# Altium schematic sheet Pont en H.SchDoc
size A4; SheetNumber: 1; SheetTotal: 1
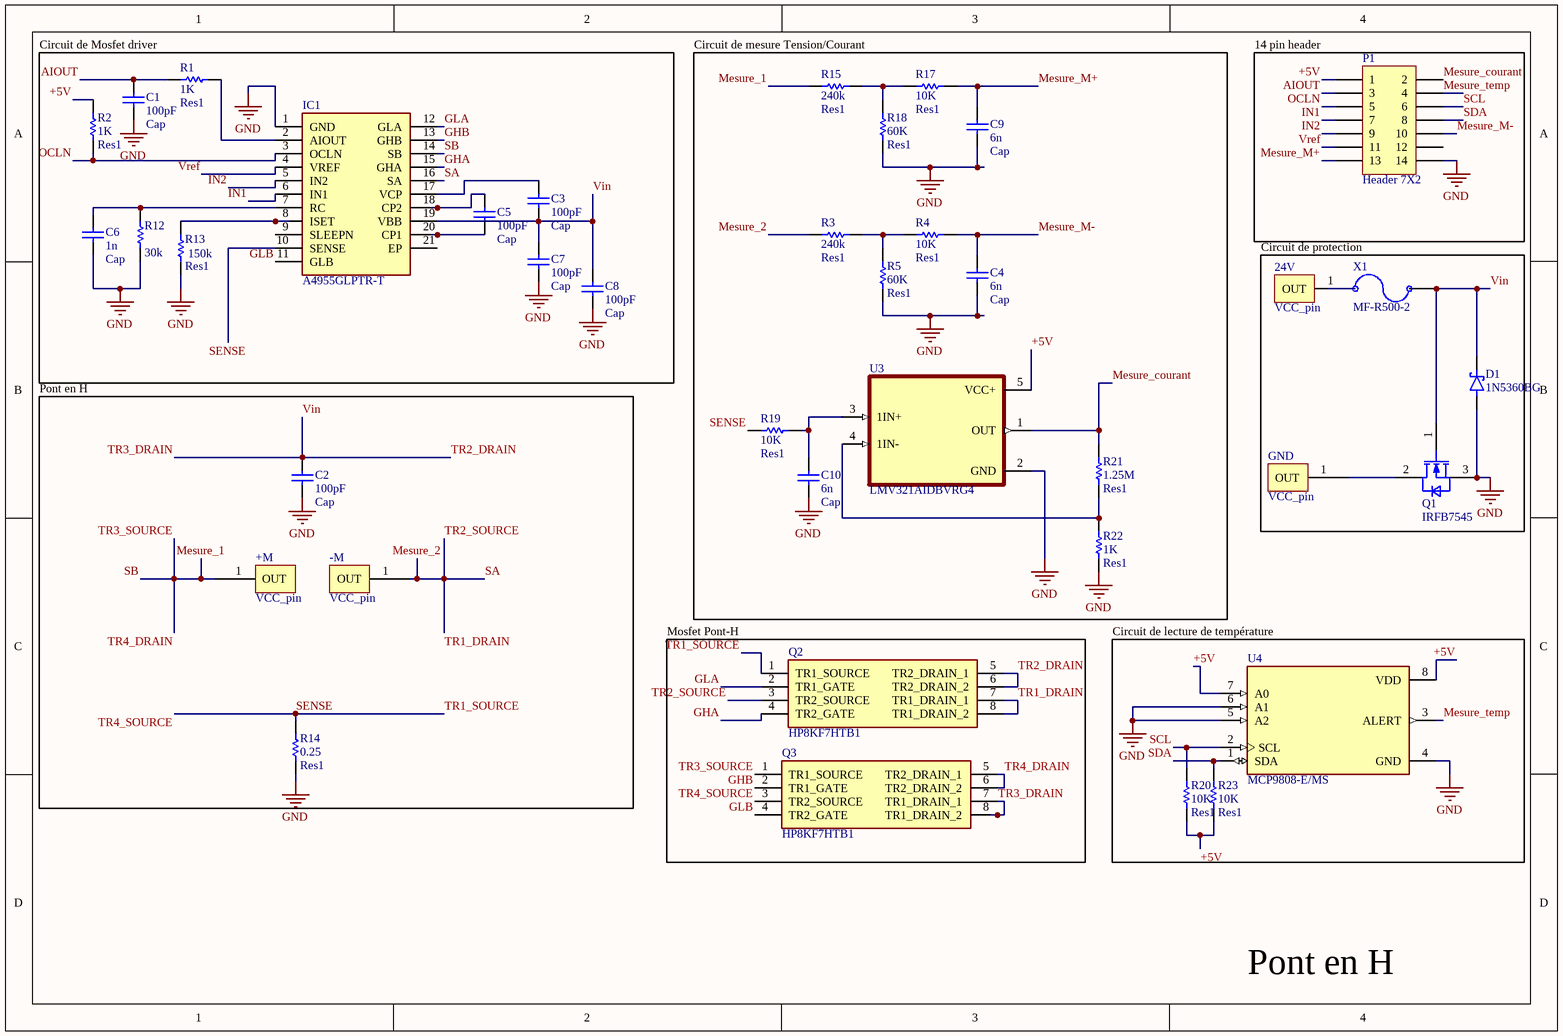
[diagram p0: Pont en H.SchDoc]

## Parts
24V  VCC_pin  [banana_connector]
+M  VCC_pin  [banana_connector]
-M  VCC_pin  [banana_connector]
C1  Cap  value 100pF  [RAD-0.3]
C2  Cap  value 100pF  [RAD-0.3]
C3  Cap  value 100pF  [RAD-0.3]
C4  Cap  value 6n  [RAD-0.3]
C5  Cap  value 100pF  [RAD-0.3]
C6  Cap  value 1n  [RAD-0.3]
C7  Cap  value 100pF  [RAD-0.3]
C8  Cap  value 100pF  [RAD-0.3]
C9  Cap  value 6n  [C1206]
C10  Cap  value 6n  [RAD-0.3]
D1  1N5360BG  [DIOAD1543W101L863D368]
GND  VCC_pin  [banana_connector]
IC1  A4955GLPTR-T  [A4405KLPTRT]
P1  Header 7X2  [HDR2X7]
Q1  IRFB7545  [IFX-PG-TO220-3-904]
Q2  HP8KF7HTB1  [HP8KC6TB1]
Q3  HP8KF7HTB1  [HP8KC6TB1]
R1  Res1  value 1K  [AXIAL-0.3]
R2  Res1  value 1K  [AXIAL-0.3]
R3  Res1  value 240k  [AXIAL-0.3]
R4  Res1  value 10K  [AXIAL-0.3]
R5  Res1  value 60K  [AXIAL-0.3]
R12  30k  [AXIAL-0.3]
R13  Res1  value 150k  [AXIAL-0.3]
R14  Res1  value 0.25  [AXIAL-0.3]
R15  Res1  value 240k  [AXIAL-0.3]
R17  Res1  value 10K  [AXIAL-0.3]
R18  Res1  value 60K  [AXIAL-0.3]
R19  Res1  value 10K  [AXIAL-0.3]
R20  Res1  value 10K  [AXIAL-0.3]
R21  Res1  value 1.25M  [AXIAL-0.3]
R22  Res1  value 1K  [AXIAL-0.3]
R23  Res1  value 10K  [AXIAL-0.3]
U3  LMV321AIDBVRG4  [SOT95P280X145-5N]
U4  MCP9808-E/MS  [SOP65P490X110-8N]
X1  MF-R500-2  [MF-R500-2]

## Blocks framed on the sheet
Circuit de Mosfet driver: C1 C3 C5-C8 IC1 R1 R2 R12 R13
Circuit de mesure Tension/Courant: C4 C9 C10 R3-R5 R15 R17-R19 R21 R22 U3
14 pin header: P1
Circuit de protection: 24V D1 GND Q1 X1
Pont en H: +M -M C2 R14
Mosfet Pont-H: Q2 Q3
Circuit de lecture de température: R20 R23 U4

## Nets
GND: C1.1 C2.1 C4.1 C6.1 C7.1 C8.1 C9.1 C10.1 D1.2(A) IC1.1(GND) P1.14 Q1.3(SOURCE) R5.1 R12.1 R13.1 R14.1 R18.1 R22.1 U3.2(GND) U4.4(GND) U4.5(A2) U4.6(A1)
+5V: P1.1 R2.2 R20.1 R23.1 U3.5(VCC+) U4.7(A0) U4.8(VDD)
AIOUT: C1.2 P1.3 R1.2
GHA: IC1.15(GHA) Q2.4(TR2_GATE)
GHB: IC1.13(GHB) Q3.2(TR1_GATE)
GLA: IC1.12(GLA) Q2.2(TR1_GATE)
GLB: IC1.11(GLB) Q3.4(TR2_GATE)
IN1: IC1.6(IN1) P1.7
IN2: IC1.5(IN2) P1.9
Mesure_1: +M.1(OUT) IC1.14(SB) Q3.1(TR1_SOURCE) Q3.5(TR2_DRAIN_1) Q3.6(TR2_DRAIN_2) R15.1  [also labelled SB, TR3_SOURCE, TR4_DRAIN]
Mesure_2: -M.1(OUT) IC1.16(SA) Q2.3(TR2_SOURCE) Q2.7(TR1_DRAIN_1) Q2.8(TR1_DRAIN_2) R3.1  [also labelled SA, TR1_DRAIN, TR2_SOURCE]
Mesure_courant: P1.2 R21.2 U3.1(OUT)
Mesure_M+: C9.2 P1.13 R17.2
Mesure_M-: C4.2 P1.10 R4.2
Mesure_temp: P1.4 U4.3(ALERT)
OCLN: IC1.3(OCLN) P1.5 R2.1
SCL: P1.6 R20.2 U4.2(SCL)
SDA: P1.8 R23.2 U4.1(SDA)
SENSE: IC1.10(SENSE) Q2.1(TR1_SOURCE) Q3.3(TR2_SOURCE) R14.2 R19.1  [also labelled TR1_SOURCE, TR4_SOURCE]
TR2_DRAIN: C2.2 C3.1 C7.2 C8.2 D1.1(K) IC1.19(VBB) Q1.1(GATE) Q2.5(TR2_DRAIN_1) Q2.6(TR2_DRAIN_2) Q3.7(TR1_DRAIN_1) Q3.8(TR1_DRAIN_2) X1.2  [also labelled TR3_DRAIN, Vin]
Vref: IC1.4(VREF) P1.11
Net24V_1: 24V.1(OUT) X1.1
NetC3_2: C3.2 IC1.17(VCP)
NetC5_1: C5.1 IC1.20(CP1)
NetC5_2: C5.2 IC1.18(CP2)
NetC6_2: C6.2 IC1.7(RC) R12.2
NetC10_2: C10.2 R19.2 U3.3(1IN+)
NetGND_1: GND.1(OUT) Q1.2(DRAIN)
NetIC1_2: IC1.2(AIOUT) R1.1
NetIC1_8: IC1.8(ISET) R13.2
NetR3_2: R3.2 R4.1 R5.2
NetR15_2: R15.2 R17.1 R18.2
NetR21_1: R21.1 R22.2 U3.4(1IN-)

Not connected (* = marked no-connect by the designer): IC1 9(SLEEPN) 21(EP); P1 12

## Notes on the sheet
- Pont en H

## Library data of the parts
C1-C10 = Cap: Capacitor; Published: 8-Jun-2000; LatestRevisionDate: 17-Jul-2002; LatestRevisionNote: Re-released for DXP Platform.; PackageReference: RAD-0.3; Publisher: Altium Limited; PackageDescription: Radial Cap, Thru-Hole; 2 Leads; 0.3 in Pin Spacing
D1 = 1N5360BG: MF: {'manufacturer': u'onsemi'}; Package: None; Price: None; Value: *; MP: 1N5360BG; Availability: Unavailable
IC1 = A4955GLPTR-T: Integrated Circuit; Manufacturer_Name: Allegro Microsystems; Datasheet Link: https://www.allegromicro.com/~/media/Files/Datasheets/A4955-Datasheet.ashx; Height: 1.2mm; Manufacturer_Part_Number: A4955GLPTR-T; Mouser Part Number: 250-A4955GLPTR-T; Mouser Price/Stock: https://www.mouser.co.uk/ProductDetail/Allegro-MicroSystems/A4955GLPTR-T?qs=pUKx8fyJudCBeWBIJtW5Eg%3D%3D; Arrow Part Number: A4955GLPTR-T; Arrow Price/Stock: null?region=nac
P1 = Header 7X2: Header, 7-Pin, Dual row; LatestRevisionDate: 17-Jul-2002; LatestRevisionNote: Re-released for DXP Platform.; Publisher: Altium Limited
Q1 = IRFB7545: Insulated-Gate Field-Effect Transistor (IGFET), N-Channel, Enhancement, Body Diode, Pin 1 Gate, 2 Drain, 3 Source, 3 Pins; Manufacturer: Infineon Technologies; Manufacturer Order Number: IRFB7545; PackageReference: PG-TO220-3-904
Q2 Q3 = HP8KF7HTB1: MOSFET (N-Channel); Manufacturer_Name: ROHM Semiconductor; Datasheet Link: https://fscdn.rohm.com/en/products/databook/datasheet/discrete/transistor/mosfet/hp8kf7htb1-e.pdf; Height: 1.1mm; Manufacturer_Part_Number: HP8KF7HTB1
R1-R5 R12-R15 R17-R23 = Res1: Resistor; Published: 8-Jun-2000; LatestRevisionDate: 17-Jul-2002; LatestRevisionNote: Re-released for DXP Platform.; PackageReference: AXIAL-0.3; Publisher: Altium Limited; PackageDescription: Axial Device, Thru-Hole; 2 Leads; 0.3 in Pin Spacing
U3 = LMV321AIDBVRG4: Single Low-Voltage Rail-to-Rail Output Operational Amplifier see LMV321A for upgraded version 5-SOT-23 -40 to 125; MF: Texas Instruments; MP: LMV321IDBVRG4; SnapEDA_Link: https://www.snapeda.com/parts/LMV321IDBVRG4/Texas+Instruments/view-part/?ref=snap; Package: SOT-23-5 Texas Instruments; Value: *; Check_prices: https://www.snapeda.com/parts/LMV321IDBVRG4/Texas+Instruments/view-part/?ref=eda
U4 = MCP9808-E/MS: Microchip MCP9808-E/MS Temperature Sensor 8-Pin MSOP, -40 - +125 degC | Microchip Technology Inc. MCP9808-E/MS; SnapEDA_Link: https://www.snapeda.com/parts/MCP9808-E/MS/Microchip/view-part/?ref=snap; Package: MSOP-8 Microchip; Value: *; MF: Microchip; MP: MCP9808-E/MS; Check_prices: https://www.snapeda.com/parts/MCP9808-E/MS/Microchip/view-part/?ref=eda